# EasyEDA Pro project TC264D主板1.0.eprj, schematic Schematic1

## Sheets
1 power: Board Name: Board1; Create Date: 2024-11-12; Page Name: power; Project Name: motor; Schematic Name: Schematic1; Update Date: 2025-04-30; Company: 嘉立创EDA; Page Size: A4; Version: V1.0
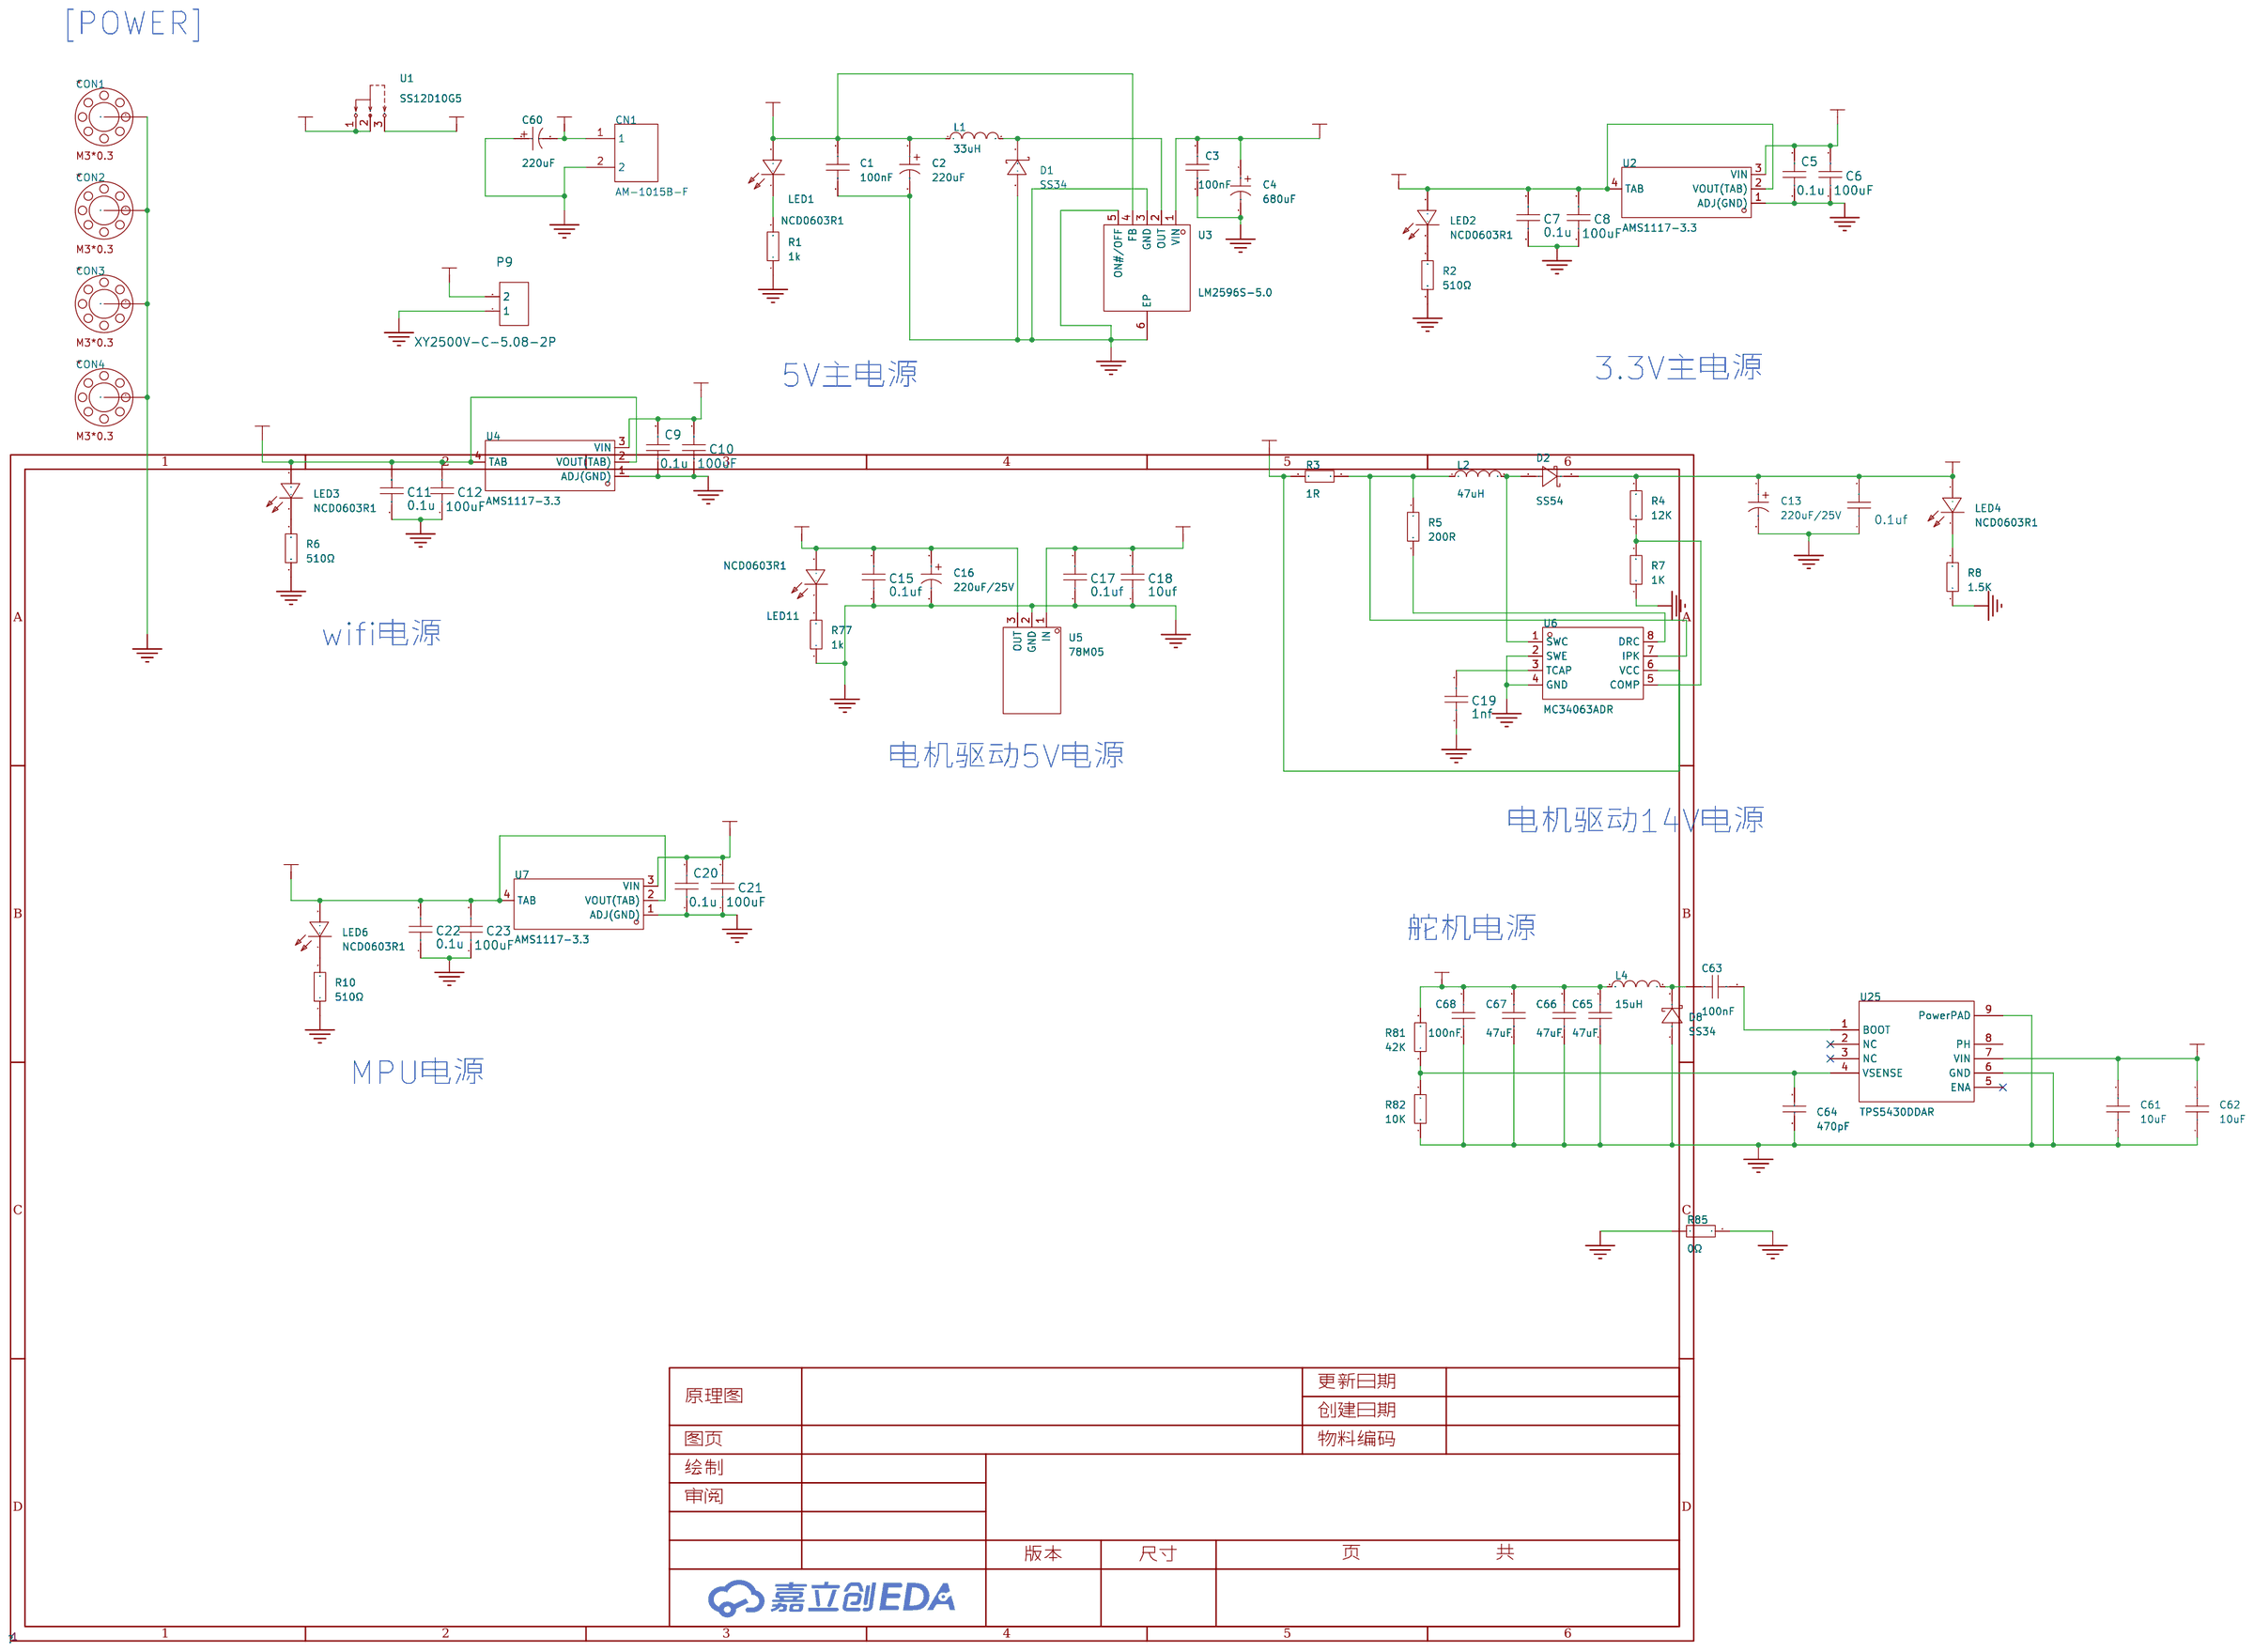
[diagram p0: power]
2 MCU: Create Date: 2025-02-13; Page Name: MCU; Update Date: 2025-05-03
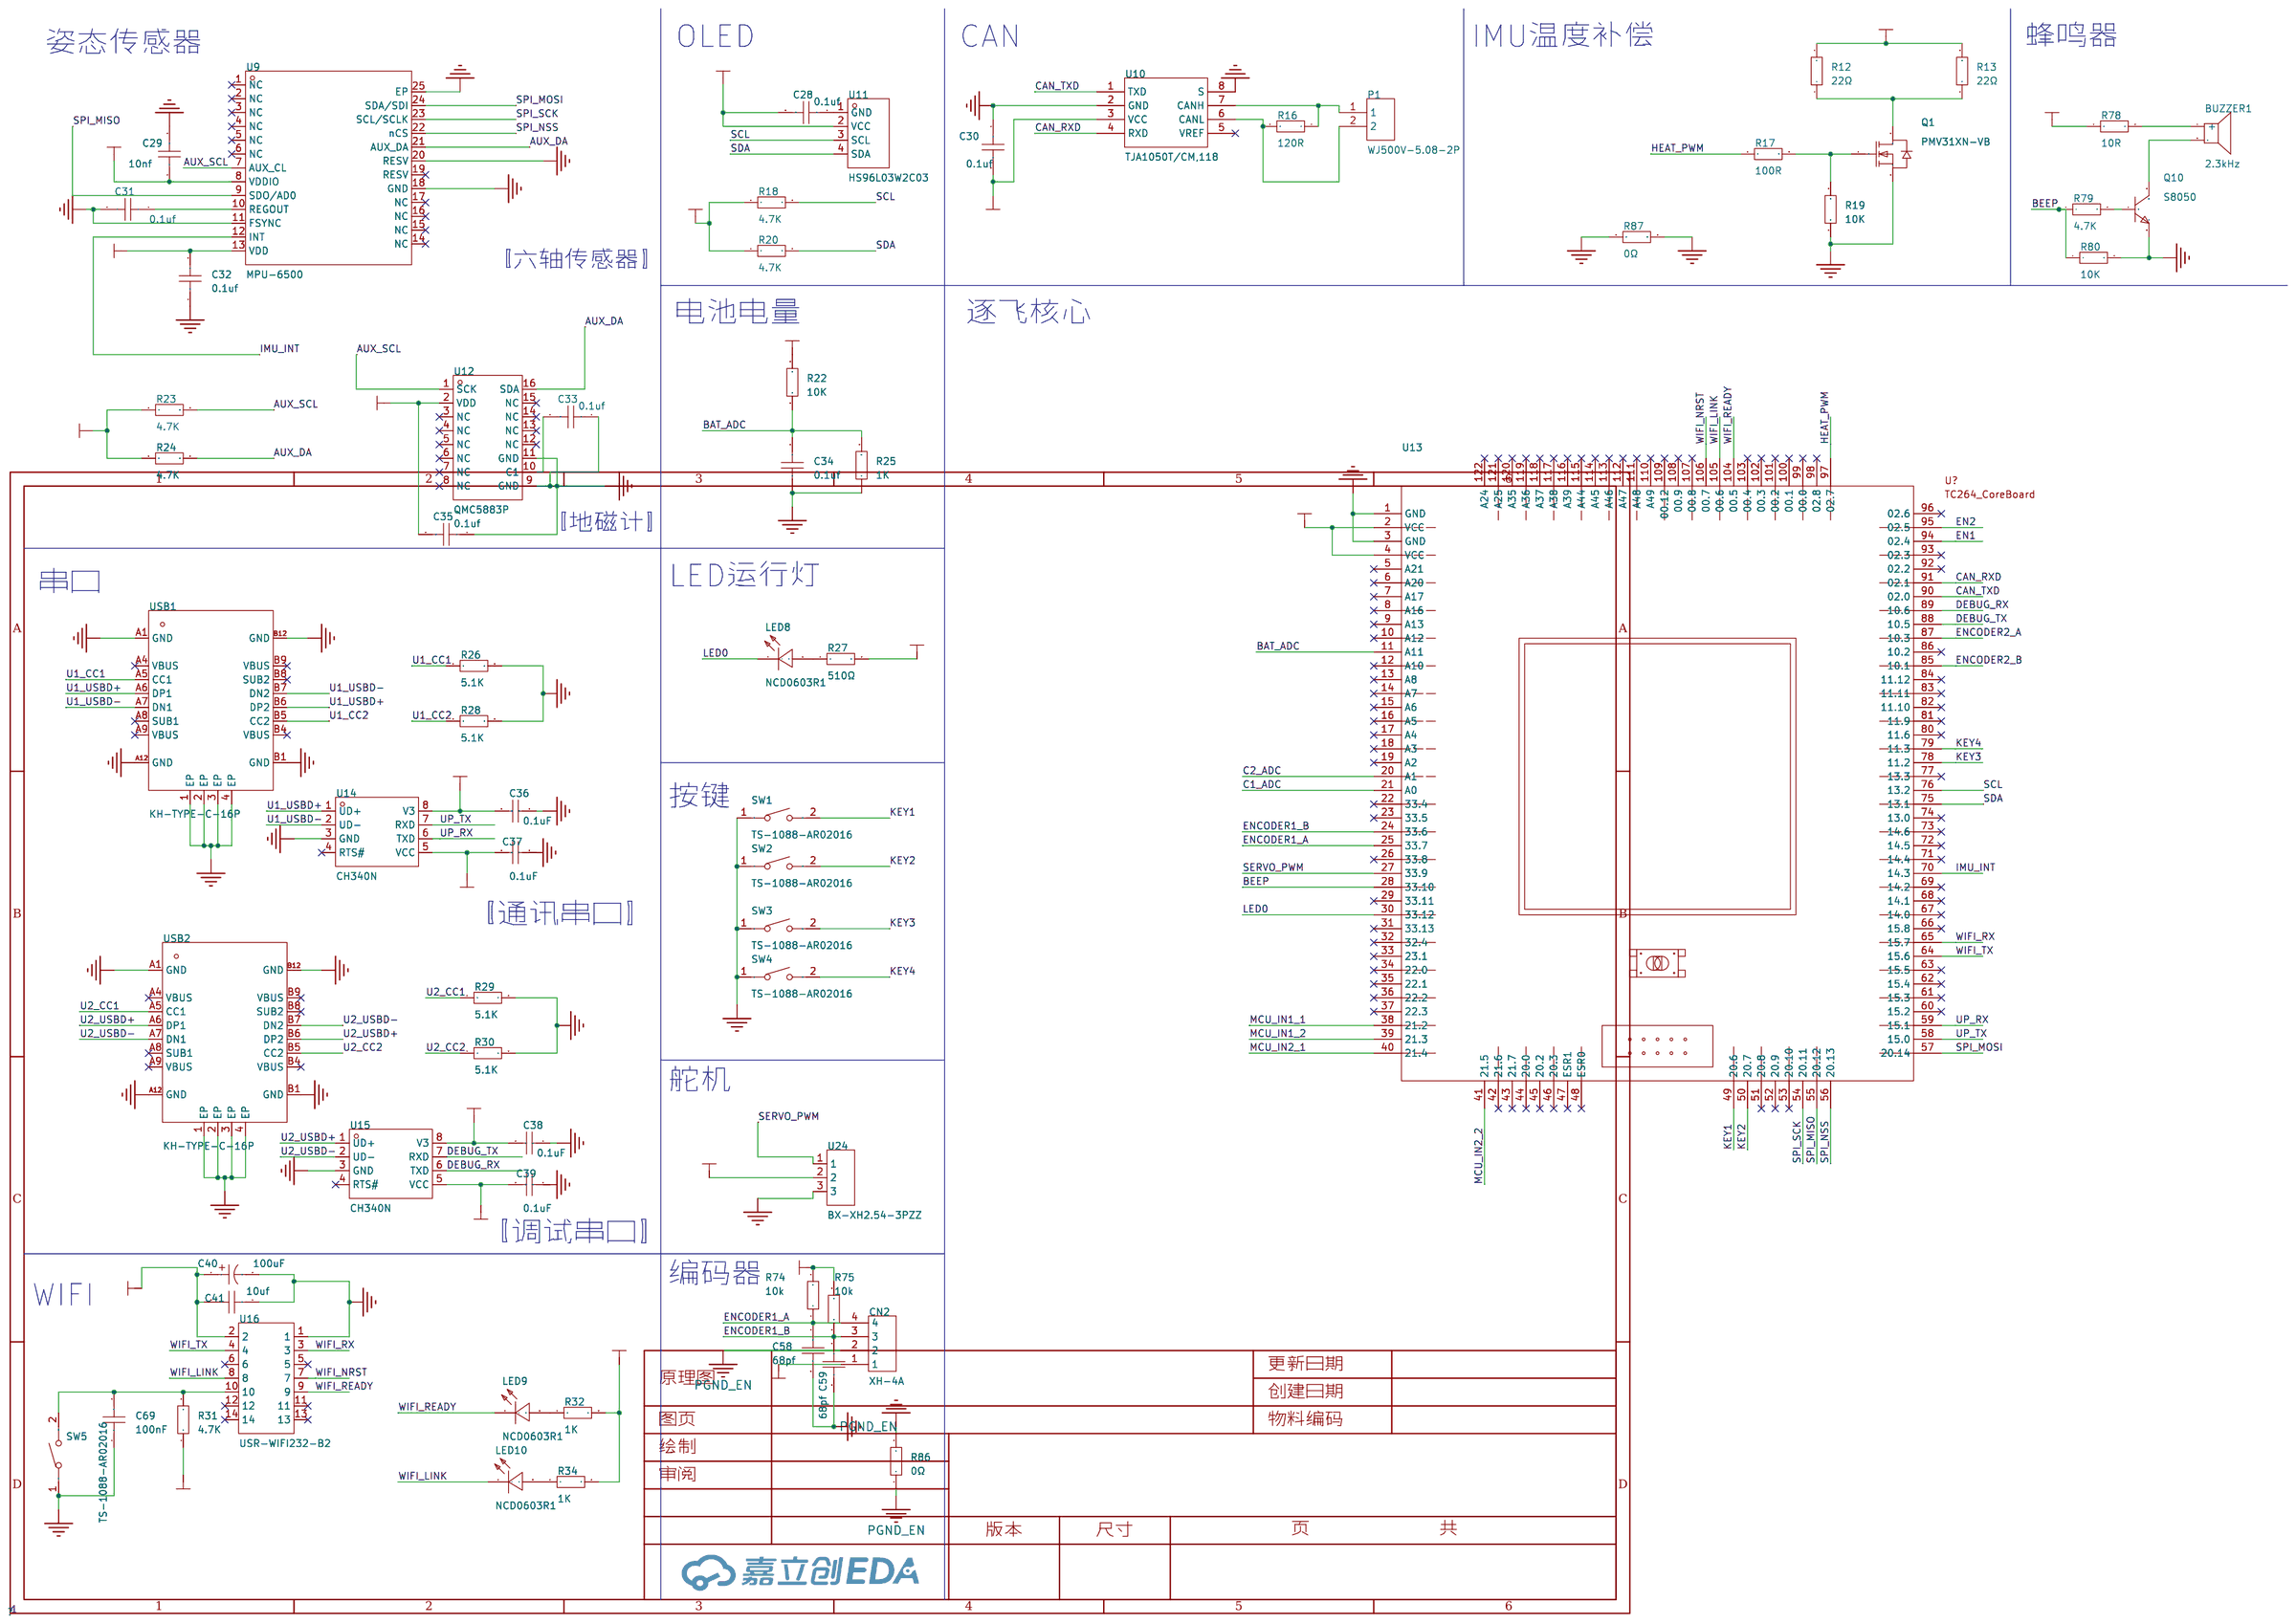
[diagram p1: MCU]
3 motor: Create Date: 2025-02-13; Page Name: motor; Update Date: 2025-04-28
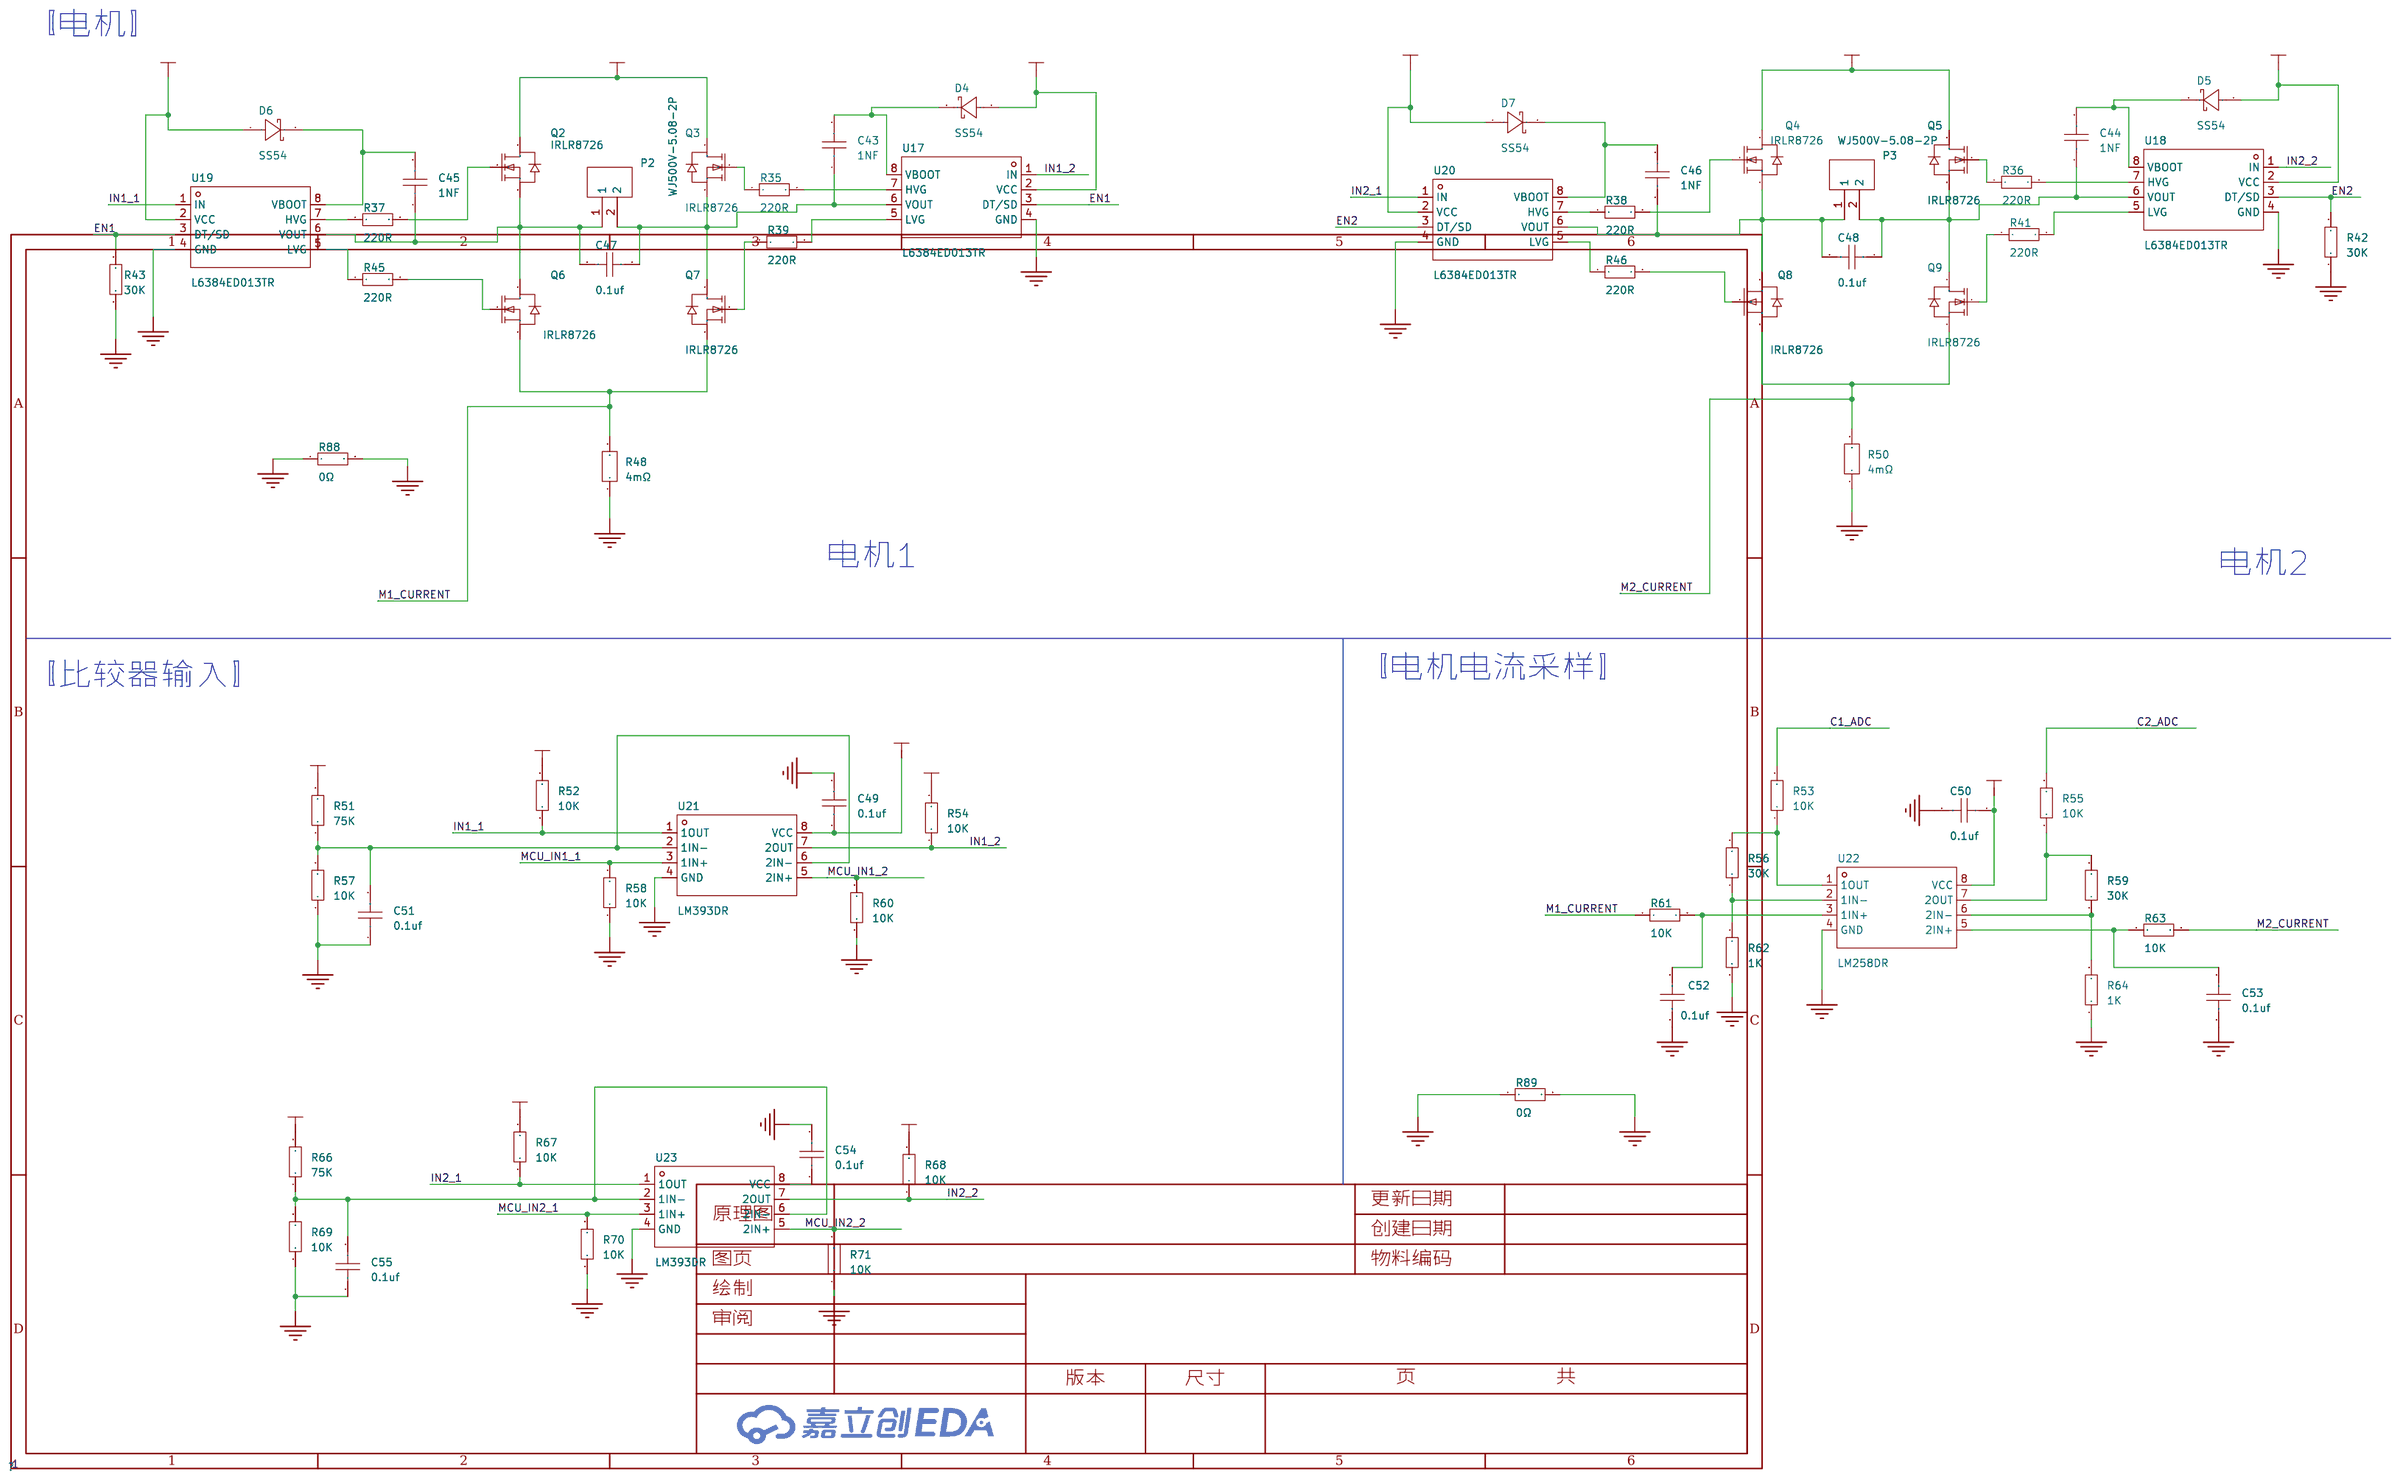
[diagram p2: motor]

## Parts
sheet MCU
BUZZER1  2.3kHz  [BUZ-TH_BD12.0-P7.60-D0.6-FD]
C28  0.1uf  [C0603]  (no BOM)
C29  10nf  [C0603]
C30  0.1uf  [C0603]
C31  0.1uf  [C0603]
C32  0.1uf  [C0603]
C33  0.1uf  [C0603]
C34  0.1uf  [C0603]
C35  0.1uf  [C0603]
C36  0.1uF  [C0603]
C37  0.1uF  [C0603]
C38  0.1uF  [C0603]
C39  0.1uF  [C0603]
C40  100uF  [CAP-SMD_BD5.0-L5.3-W5.3-FD]
C41  10uf  [C0603]
C58  68pf  [C0603]
C59  68pf  [C0603]
C69  100nF  [C0603]
CN2  XH-4A  [CONN-TH_4P-P2.50_XH-4A]
LED8  NCD0603R1  [LED0603-RD_RED]
LED9  NCD0603R1  [LED0603-RD_RED]
LED10  NCD0603R1  [LED0603-RD_RED]
P1  WJ500V-5.08-2P  [CONN-TH_2P-P5.00_WJ500V-5.08-2P]
Q1  PMV31XN-VB  [SOT-23-3_L2.9-W1.5-P1.90-LS2.6-BR]
Q10  S8050  [SOT-23-3_L2.9-W1.3-P1.90-LS2.3-BR]
R12  22Ω  [R1206]
R13  22Ω  [R1206]
R16  120R  [R0603]
R17  100R  [R0603]
R18  4.7K  [R0603]  (no BOM)
R19  10K  [R0603]
R20  4.7K  [R0603]  (no BOM)
R22  10K  [R0603]
R23  4.7K  [R0603]
R24  4.7K  [R0603]
R25  1K  [R0603]
R26  5.1K  [R0603]
R27  510Ω  [R0603]
R28  5.1K  [R0603]
R29  5.1K  [R0603]
R30  5.1K  [R0603]
R31  4.7K  [R0603]
R32  1K  [R0603]
R34  1K  [R0603]
R74  10k  [R0603]
R75  10k  [R0603]
R78  10R  [R0603]
R79  4.7K  [R0603]
R80  10K  [R0603]
R86  0Ω  [R1206]
R87  0Ω  [R1206]
SW1  TS-1088-AR02016  [SW-SMD_L3.9-W3.0-P4.45]
SW2  TS-1088-AR02016  [SW-SMD_L3.9-W3.0-P4.45]
SW3  TS-1088-AR02016  [SW-SMD_L3.9-W3.0-P4.45]
SW4  TS-1088-AR02016  [SW-SMD_L3.9-W3.0-P4.45]
SW5  TS-1088-AR02016  [SW-SMD_L3.9-W3.0-P4.45]
U9  MPU-6500  [QFN-24_L3.0-W3.0-P0.40-BL-EP]
U10  TJA1050T/CM,118  [SOIC-8_L5.0-W4.0-P1.27-LS6.0-BL]
U11  HS96L03W2C03  [OLED-TH_L27.8-W27.2-P2.54_C9900033791]  (no BOM)
U12  QMC5883P  [LGA-16_L3.0-W3.0-P0.50-BL_SQ]
U13  -  [逐飞核心板]
U14  CH340N  [SOP-8_L4.9-W3.9-P1.27-LS6.0-BL]
U15  CH340N  [SOP-8_L4.9-W3.9-P1.27-LS6.0-BL]
U16  USR-WIFI232-B2  [COMM-TH_USR-WIFI232-B2]
U24  BX-XH2.54-3PZZ  [CONN-TH_3P-P2.50_BX-XH2.54-3PZZ]
USB1  KH-TYPE-C-16P  [USB-C-SMD_KH-TYPE-C-16P]
USB2  KH-TYPE-C-16P  [USB-C-SMD_KH-TYPE-C-16P]
sheet motor
C43  1NF  [C0603]
C44  1NF  [C0603]
C45  1NF  [C0603]
C46  1NF  [C0603]
C47  0.1uf  [C0805]
C48  0.1uf  [C0805]
C49  0.1uf  [C0603]
C50  0.1uf  [C0603]
C51  0.1uf  [C0603]
C52  0.1uf  [C0603]
C53  0.1uf  [C0603]
C54  0.1uf  [C0603]  (no BOM)
C55  0.1uf  [C0603]  (no BOM)
D4  SS54  [SMA_L4.3-W2.6-LS5.0-FD]
D5  SS54  [SMA_L4.3-W2.6-LS5.0-FD]
D6  SS54  [SMA_L4.3-W2.6-LS5.0-FD]
D7  SS54  [SMA_L4.3-W2.6-LS5.0-FD]
P2  WJ500V-5.08-2P  [CONN-TH_2P-P5.00_WJ500V-5.08-2P]
P3  WJ500V-5.08-2P  [CONN-TH_2P-P5.00_WJ500V-5.08-2P]
Q2  IRLR8726  [TO-252-2_L6.6-W6.1-P4.57-LS10.1-BR-CW]
Q3  IRLR8726  [TO-252-2_L6.6-W6.1-P4.57-LS10.1-BR-CW]
Q4  IRLR8726  [TO-252-2_L6.6-W6.1-P4.57-LS10.1-BR-CW]
Q5  IRLR8726  [TO-252-2_L6.6-W6.1-P4.57-LS10.1-BR-CW]
Q6  IRLR8726  [TO-252-2_L6.6-W6.1-P4.57-LS10.1-BR-CW]
Q7  IRLR8726  [TO-252-2_L6.6-W6.1-P4.57-LS10.1-BR-CW]
Q8  IRLR8726  [TO-252-2_L6.6-W6.1-P4.57-LS10.1-BR-CW]
Q9  IRLR8726  [TO-252-2_L6.6-W6.1-P4.57-LS10.1-BR-CW]
R35  220R  [R0603]
R36  220R  [R0603]
R37  220R  [R0603]
R38  220R  [R0603]
R39  220R  [R0603]
R41  220R  [R0603]
R42  30K  [R0603]
R43  30K  [R0603]
R45  220R  [R0603]
R46  220R  [R0603]
R48  4mΩ  [RES-SMD_L6.4-W3.2-R2512]
R50  4mΩ  [RES-SMD_L6.4-W3.2-R2512]
R51  75K  [R0603]
R52  10K  [R0603]
R53  10K  [R0603]
R54  10K  [R0603]
R55  10K  [R0603]
R56  30K  [R0603]
R57  10K  [R0603]
R58  10K  [R0603]
R59  30K  [R0603]
R60  10K  [R0603]
R61  10K  [R0603]
R62  1K  [R0603]
R63  10K  [R0603]
R64  1K  [R0603]
R66  75K  [R0603]  (no BOM)
R67  10K  [R0603]  (no BOM)
R68  10K  [R0603]  (no BOM)
R69  10K  [R0603]  (no BOM)
R70  10K  [R0603]  (no BOM)
R71  10K  [R0603]  (no BOM)
R88  0Ω  [R1206]
R89  0Ω  [R1206]
U17  L6384ED013TR  [SOP-8_L4.9-W3.9-P1.27-LS6.0-BL]
U18  L6384ED013TR  [SOP-8_L4.9-W3.9-P1.27-LS6.0-BL]
U19  L6384ED013TR  [SOP-8_L4.9-W3.9-P1.27-LS6.0-BL]
U20  L6384ED013TR  [SOP-8_L4.9-W3.9-P1.27-LS6.0-BL]
U21  LM393DR  [SOIC-8_L5.0-W4.0-P1.27-LS6.0-BL]
U22  LM258DR  [SOIC-8_L5.0-W4.0-P1.27-LS6.0-BL]
U23  LM393DR  [SOIC-8_L5.0-W4.0-P1.27-LS6.0-BL]  (no BOM)
sheet power
C1  100nF  [C0603]
C2  220uF  [CAP-SMD_BD6.3-L6.6-W6.6-FD]
C3  100nF  [C0603]
C4  680uF  [CAP-SMD_BD10.0-L10.3-W10.3-LS10.9-FD]
C5  0.1u  [C0603]
C6  100uF  [C0603]
C7  0.1u  [C0603]
C8  100uF  [C0603]
C9  0.1u  [C0603]
C10  100uF  [C0603]
C11  0.1u  [C0603]
C12  100uF  [C0603]
C13  220uF/25V  [CAP-SMD_BD6.3-L6.6-W6.6-LS7.8-FD]
C14  0.1uf  [C0603]
C15  0.1uf  [C0603]
C16  220uF/25V  [CAP-SMD_BD6.3-L6.6-W6.6-LS7.8-FD]
C17  0.1uf  [C0603]
C18  10uf  [C0603]
C19  1nf  [C0603]
C20  0.1u  [C0603]
C21  100uF  [C0603]
C22  0.1u  [C0603]
C23  100uF  [C0603]
C60  220uF  [CAP-SMD_BD10.0-L10.3-W10.3-LS11.3-FD]
C61  10uF  [C0805]
C62  10uF  [C0805]
C63  100nF  [C0603]
C64  470pF  [C0603]
C65  47uF  [C1206]
C66  47uF  [C1206]
C67  47uF  [C1206]
C68  100nF  [C0603]
CN1  AM-1015B-F  [CONN-TH_AM-1015B-F]
CON1  -  [CON_M3*0.3]
CON2  -  [CON_M3*0.3]
CON3  -  [CON_M3*0.3]
CON4  -  [CON_M3*0.3]
D1  SS34  [SMA_L4.3-W2.6-LS5.0-FD]
D2  SS54  [SMA_L4.3-W2.6-LS5.0-FD]
D8  SS34  [SMA_L4.3-W2.6-LS5.0-FD]
L1  33uH  [IND-SMD_L7.1-W6.6]
L2  47uH  [IND-SMD_L7.3-W6.8]
L4  15uH  [IND-SMD_L7.0-W6.6_FXL0630]
LED1  NCD0603R1  [LED0603-RD_RED]
LED2  NCD0603R1  [LED0603-RD_RED]
LED3  NCD0603R1  [LED0603-RD_RED]
LED4  NCD0603R1  [LED0603-RD_RED]
LED6  NCD0603R1  [LED0603-RD_RED]
LED11  NCD0603R1  [LED0603-RD_RED]
P9  XY2500V-C-5.08-2P  [CONN-TH_XY2500V-C-5.08-2P]
R1  1k  [R0603]
R2  510Ω  [R0603]
R3  1R  [R0603]
R4  12K  [R0603]
R5  200R  [R0603]
R6  510Ω  [R0603]
R7  1K  [R0603]
R8  1.5K  [R0603]
R10  510Ω  [R0603]
R77  1k  [R0603]
R81  42K  [R0603]
R82  10K  [R0603]
R85  0Ω  [R1206]
U1  SS12D10G5  [SW-TH_SHOU-HAN_SS12D10G4]
U2  AMS1117-3.3  [SOT-223-4_L6.5-W3.5-P2.30-LS7.0-BR]
U3  LM2596S-5.0  [TO-263-5_L10.2-W8.9-P1.70-BR]
U4  AMS1117-3.3  [SOT-223-4_L6.5-W3.5-P2.30-LS7.0-BR]
U5  78M05  [TO-252-2_L6.6-W6.1-P4.57-LS9.9-BR-CW]
U6  MC34063ADR  [SOIC-8_L4.9-W3.9-P1.27-LS6.0-BL]
U7  AMS1117-3.3  [SOT-223-4_L6.5-W3.5-P2.30-LS7.0-BR]
U25  TPS5430DDAR  [ESOP-8_L4.9-W3.9-P1.27-LS6.0-TL-EP]

## Library data of the parts
BUZZER1 = TMB12A03: 驱动方式:有源(内含驱动线路);构造类型:电磁式;频率:2.3kHz;声压(SPL):85dB;; Supplier Part: C96222; Manufacturer: 华能; Supplier Footprint: 插件,D=12mm; JLCPCB Part Class: 扩展库; Datasheet: https://atta.szlcsc.com/upload/public/pdf/source/20241025/428C1CFCAF77BD6D816EEFE9285ABDAA.pdf; Supplier: LCSC; Driver Circuitry: 有源(内含驱动线路); Technology: 电磁式; Voltage - Supply: 1.5V~4V; Sound Pressure Level(SPL): 85dB; Diameter(φD): 12mm; Height: 9.8mm
C1 C3 C28-C35 C41 C43-C55 C58 C59 C63 C68 C69 = CAP_0603: Supplier Footprint: 0603
C36-C39 = 0805B104K500NT: 容值:100nF;精度:±10%;额定电压:50V;材质(温度系数):X7R;; LCSC Part Name: 100nF ±10% 50V; Supplier Part: C38141; Manufacturer: FH(风华); Supplier Footprint: 0805; JLCPCB Part Class: Extended Part; Datasheet: https://atta.szlcsc.com/upload/public/pdf/source/20170923/C38141_1506149447419988747.pdf; Supplier: LCSC; Tolerance: ±10%; Voltage Rated: 50V; Temperature Coefficient: X7R
C40 = RVT1A101M0505_C18221491: 容值:100uF;精度:±20%;额定电压:10V;纹波电流:39mA@120Hz;; LCSC Part Name: 100uF ±20% 10V; Supplier Part: C18221491; Manufacturer: RS(容硕); Manufacturer Part: RVT1A101M0505; Supplier Footprint: SMD,D5xL5.4mm; JLCPCB Part Class: 扩展库; Datasheet: https://atta.szlcsc.com/upload/public/pdf/source/20231012/A9BDA4D9DCF59DA62A45967533C4FC4C.pdf; Supplier: LCSC; Tolerance: ±20%; Voltage Rated: 10V; Ripple Current: 39mA@120Hz
CN2 = XH-4A_C37815: 插针结构:1x4P;间距:2.5mm;安装方式:直插;参考系列:XH;总PIN数:4P;排数:1;每排PIN数:4;行距:-;额定电流:-;触头材质:-;触头镀层:-;工作温度:-;; LCSC Part Name: 1x4P 间距:2.5mm 直插 系列:XH; Supplier Part: C37815; Manufacturer: BOOMELE(博穆精密); Supplier Footprint: 插件,P=2.5mm; JLCPCB Part Class: 扩展库; Datasheet: https://atta.szlcsc.com/upload/public/pdf/source/20181205/C146112_2CB31444E6250AC61E2A41A9A8391D5F.pdf; Supplier: LCSC; Pins Structure: 1x4P; Pitch: 2.5mm; Mounting Type: 直插; Reference Series: XH; Number of Pins: 4P; Number of Rows: 1; Number of PINs Per Row: 4
LED1-LED4 LED6 LED8-LED11 = NCD0603R1_C84263: 灯头类型:-;发光颜色:红色;正向电压(VF):1.6V~2.6V;功率:65mW;正向电流:20mA;主波长:615nm~630nm;二极管配置:独立二极管;透镜颜色:无色透明透镜;色温:-;发光强度:80mcd~220mcd;发光角度:130°;载带方式:-;工作温度:-30℃~+85℃;; Supplier Part: C84263; Manufacturer: 国星光电; Supplier Footprint: 0603; JLCPCB Part Class: Extended Part; Datasheet: https://atta.szlcsc.com/upload/public/pdf/source/20200820/C84263_DABC6A75E58F576973B407FDBA283D60.pdf; Supplier: LCSC; Emitted Color: 红色; Forward Voltage (VF): 1.6V~2.6V; Power Dissipation: 65mW; Forward Current: 20mA; Dominant Wavelength: 615nm~630nm; Diode Configuration: 独立二极管; Lens Color: 无色透明透镜; Luminous Intensity: 80mcd~220mcd; Viewing Angle: 130°; Operating Temperature: -30℃~+85℃
P1-P3 = WJ500V-5.08-2P: 结构:1x2P;间距:5.08mm;颜色:绿色;安装方式:直插;额定电流:18A;额定电压:250V;排数:1;线规 - AWG:14~30;线规 - 平方毫米:2.5;每排PIN数:2;触头材质:-;触头镀层:-;工作温度范围:-40℃~+105℃;焊接温度(最大值):-;; LCSC Part Name: 1x2P 5.08mm 直插 排数:1 每排P数:2; Supplier Part: C8465; Manufacturer: KANGNEX(康奈克斯电气); Supplier Footprint: 插件,P=5.08mm; JLCPCB Part Class: 扩展库; Datasheet: https://atta.szlcsc.com/upload/public/pdf/source/20191225/C8465_02D34CE5B5B4A53DF5891601D97FA9F4.pdf; Supplier: LCSC; Structure: 1x2P; Pitch: 5.08mm; Color: 绿色; Mounting Style: 直插; Current Rating (Max): 18A; Voltage Rating (Max): 250V; Number of Pins: 2P; Number of Rows: 1; Wire Gauge - AWG: 14~30; Wire Gauge - mm2: 2.5; Number of PINs Per Row: 2; Operating Temperature Range: -40℃~+105℃; Screw Specification: M2.5
Q1 = PMV31XN-VB: 类型:1个N沟道;漏源电压(Vdss):20V;连续漏极电流(Id):6A;导通电阻(RDS(on)@Vgs,Id):-;功率(Pd):1.25W;阈值电压(Vgs(th)@Id):1V@250uA;; LCSC Part Name: 1个N沟道 耐压:20V 电流:6A; Supplier Part: C7525086; Manufacturer: VBsemi(微碧半导体); Supplier Footprint: SOT-23; JLCPCB Part Class: 扩展库; Datasheet: https://atta.szlcsc.com/upload/public/pdf/source/20240805/7B1EFC21D2F0ED81C5E32452D1D3D610.pdf; Supplier: LCSC; Type: 1个N沟道; Drain Source Voltage (Vdss): 20V; Continuous Drain Current (Id): 6A; Power Dissipation (Pd): 1.25W; Gate Threshold Voltage (Vgs(th)@Id): 1V@250uA; Total Gate Charge (Qg@Vgs): 8.8nC@4.5V; Input Capacitance (Ciss@Vds): 865pF@10V; Reverse Transfer Capacitance (Crss@Vds): 55pF@10V; Operating Temperature: -55℃~+150℃@(Tj)
Q10 = S8050_C20069125: 晶体管类型:NPN;集电极电流(Ic):500mA;集射极击穿电压(Vceo):25V;耗散功率(Pd):300mW;直流电流增益(hFE):120@50mA,1.0V;; LCSC Part Name: hFE:200-350，丝印:J3Y S8050; Supplier Part: C20069125; Manufacturer: 宏嘉诚; Supplier Footprint: SOT-23; JLCPCB Part Class: 扩展库; Datasheet: https://atta.szlcsc.com/upload/public/pdf/source/20250107/343E8B94B5C24D0D65D7D4B70E0B73F6.pdf; Supplier: LCSC; type: NPN; Current - Collector(Ic): 500mA; Collector - Emitter Voltage VCEO: 25V; Pd - Power Dissipation: 300mW; DC Current Gain: 120@50mA,1.0V; Transition frequency(fT): 100MHz; Current - Collector Cutoff: 100nA; Vce Saturation(VCE(sat)): 600mV; Operating Temperature: -55℃~+150℃
R12 R13 = 1206W4F220JT5E: 电阻类型:厚膜电阻;阻值:22Ω;精度:±1%;功率:250mW;最大工作电压:200V;温度系数:±100ppm/℃;; LCSC Part Name: 22Ω ±1% 250mW 厚膜电阻; Supplier Part: C17958; Manufacturer: UNI-ROYAL(厚声); Supplier Footprint: 1206; JLCPCB Part Class: Basic Part; Datasheet: https://atta.szlcsc.com/upload/public/pdf/source/20200306/C422600_1E6D84923E4A46A82E41ADD87F860B5C.pdf; Supplier: LCSC; Type: 厚膜电阻; Tolerance: ±1%; Power(Watts): 250mW; Overload Voltage (Max): 200V; Temperature Coefficient: ±100ppm/℃; Operating Temperature Range: -55℃~+155℃
R3-R5 R7 R16-R20 R22-R25 R31 R35-R39 R41-R43 R45 R46 R51-R64 R66-R71 R78-R82 = Res_0603: Supplier Footprint: 0603
R26 R28-R30 = 0805W8F1002T5E_C17414: 电阻类型:厚膜电阻;阻值:10kΩ;精度:±1%;功率:125mW;; LCSC Part Name: 10kΩ ±1% 125mW; Supplier Part: C17414; Manufacturer: UNI-ROYAL(厚声); Manufacturer Part: 0805W8F1002T5E; Supplier Footprint: 0805; JLCPCB Part Class: 基础库; Datasheet: https://atta.szlcsc.com/upload/public/pdf/source/20200306/C422600_1E6D84923E4A46A82E41ADD87F860B5C.pdf; Supplier: LCSC; Type: 厚膜电阻; Tolerance: ±1%; Power(Watts): 125mW; Temperature Coefficient: ±100ppm/℃; Overload Voltage (Max): 150V; Operating Temperature Range: -55℃~+155℃
R1 R2 R6 R8 R10 R27 R32 R34 R74 R75 R77 = 0805W8F5100T5E: 电阻类型:厚膜电阻;阻值:510Ω;精度:±1%;功率:125mW;; LCSC Part Name: 510Ω ±1% 125mW; Supplier Part: C17734; Manufacturer: UNI-ROYAL(厚声); Supplier Footprint: 0805; JLCPCB Part Class: Basic Part; Datasheet: https://atta.szlcsc.com/upload/public/pdf/source/20200306/C422600_1E6D84923E4A46A82E41ADD87F860B5C.pdf; Supplier: LCSC; Type: 厚膜电阻; Tolerance: ±1%; Power(Watts): 125mW; Temperature Coefficient: ±100ppm/℃; Overload Voltage (Max): 150V; Operating Temperature Range: -55℃~+155℃
R85-R89 = 1206W4F0000T5E: 电阻类型:厚膜电阻;阻值:0Ω;精度:±1%;功率:250mW;最大工作电压:200V;温度系数:±800ppm/℃;; LCSC Part Name: 0Ω ±1% 250mW 厚膜电阻; Supplier Part: C17888; Manufacturer: UNI-ROYAL(厚声); Supplier Footprint: 1206; JLCPCB Part Class: 基础库; Datasheet: https://atta.szlcsc.com/upload/public/pdf/source/20200306/C422600_1E6D84923E4A46A82E41ADD87F860B5C.pdf; Supplier: LCSC; Type: 厚膜电阻; Tolerance: ±1%; Power(Watts): 250mW; Overload Voltage (Max): 200V; Temperature Coefficient: ±800ppm/℃; Operating Temperature Range: -55℃~+155℃
SW1-SW5 = TS-1088-AR02016: 电路结构:单刀单掷;按钮形状:圆形按钮;作用力:160gf;安装方式:立贴;开关长度:4mm;开关宽度:3mm;开关高度:2mm;带支架:不带;触点电流:50mA;额定电压(DC):12V;绝缘电阻:100MΩ;机械寿命:10万次;; LCSC Part Name: 4*3*2mm 立贴 轻触开关; Supplier Part: C720477; Manufacturer: XUNPU(讯普); Supplier Footprint: SMD; JLCPCB Part Class: 扩展库; Datasheet: https://atta.szlcsc.com/upload/public/pdf/source/20200810/C720475_60D09DD6C54279ADDB2DC25100F1CC11.pdf; Supplier: LCSC; Circuit: 单刀单掷; Actuator Style: 圆形按钮; Operating Force: 160gf; Mounting Style: 立贴; Switch Length: 4mm; Switch Width: 3mm; Switch Height: 2mm; Strike Gundam: 不带; Contact Current: 50mA; Voltage Rating (DC): 12V; Insulation Resistance: 100MΩ; Actuator/Cap Color: 黑色; Pin Style: SMD接片; Mechanical Life: 10万次; Operating Temperature: -30℃~+80℃
U9 = MPU-6500_C50278: 传感器类型:加速度计陀螺仪;; Supplier Part: C50278; Manufacturer: TDK InvenSense(应美盛); Supplier Footprint: QFN-24-EP(3x3); JLCPCB Part Class: 扩展库; Datasheet: https://atta.szlcsc.com/upload/public/pdf/source/20170505/1493957890595.pdf; Supplier: LCSC; Sensor Type: 加速度计陀螺仪; Operating Temperature: -40℃~+85℃
U10 = TJA1050T/CM,118: 类型:-;; LCSC Part Name: 4.75V~5.25V; Supplier Part: C6952; Manufacturer: NXP(恩智浦); Supplier Footprint: SOP-8; JLCPCB Part Class: 扩展库; Datasheet: https://www.nxp.com/docs/en/data-sheet/TJA1050.pdf; Supplier: LCSC; Supply Voltage: 4.75V~5.25V; Supply Current: 50mA
U11 = HS96L03W2C03: 主控芯片:SSD1315;接口类型:I2C;尺寸(inch):0.96;像素分辨率:128x64;; LCSC Part Name: 0.96寸OLED显示屏窄白光IIC; Supplier Part: C5248080; Manufacturer: HS(汉昇); JLCPCB Part Class: 扩展库; Datasheet: https://atta.szlcsc.com/upload/public/pdf/source/20230627/763D01F79A90007632F098068C7C8AD9.pdf; Supplier: LCSC; Main Control Chip: SSD1315; Interface Type: I2C; Size: 0.96; Pixel Resolution: 128x64; Operating Temperature: -40℃~+70℃
U12 = QMC5883P: LCSC Part Name: 三轴磁传感器; Supplier Part: C2847467; Manufacturer: QST(上海矽睿); Supplier Footprint: LGA-16(3x3); JLCPCB Part Class: 扩展库; Datasheet: https://atta.szlcsc.com/upload/public/pdf/source/20210716/C2847467_A90ABEF37B1EC59AF528AF03CB0C7271.pdf; Supplier: LCSC
U13 = tc264逐飞核心板
U14 U15 = CH340N: LCSC Part Name: USB转串口芯片 CH340; Supplier Part: C2977777; Manufacturer: WCH(南京沁恒); Supplier Footprint: SOP-8; JLCPCB Part Class: 扩展库; Datasheet: https://atta.szlcsc.com/upload/public/pdf/source/20220223/82A45E4FF89B3EDCAD50B354450A7EF4.pdf; Supplier: LCSC
U16 = USR-WIFI232-B2: LCSC Part Name: WIFI/以太网 透传模块,外置天线,需另配2.4G天线使用; Supplier Part: C250563; Manufacturer: USR(有人物联网); Supplier Footprint: SMD; JLCPCB Part Class: 扩展库; Datasheet: https://atta.szlcsc.com/upload/public/pdf/source/20180801/C250563_E3CDB6C7BB01B0CE86E206FDB869E694.pdf; Supplier: LCSC
U24 = BX-XH2.54-3PZZ: 插针结构:1x3P;间距:2.5mm;安装方式:直插;参考系列:XH;总PIN数:3P;排数:1;每排PIN数:3;行距:-;额定电流:3A;触头材质:黄铜;触头镀层:锡;工作温度:-25℃~+85℃;; LCSC Part Name: 1x3P 间距:2.5mm 直插 系列:XH; Supplier Part: C18077834; Manufacturer: Bossie(博锡); Supplier Footprint: 插件,P=2.54mm; JLCPCB Part Class: 扩展库; Datasheet: https://atta.szlcsc.com/upload/public/pdf/source/20231017/BF89167887E1F965B2791D14EC788A09.pdf; Supplier: LCSC; Pins Structure: 1x3P; Pitch: 2.5mm; Mounting Type: 直插; Reference Series: XH; Number of Pins: 3P; Number of Rows: 1; Number of PINs Per Row: 3; Current Rating: 3A; Contact Material: 黄铜; Contact Plating: 锡; Operating Temperature: -25℃~+85℃; Voltage Rating: 250V; Plastic Material: PA66; Flame Retardant Rating: UL94V-0; Color: 白色; Z-Height of the Board: 7mm; X-Length of Bottom Edge on Board (Spacing Line): 10mm; Y-Width of Bottom Edge on Board: 5.9mm
USB1 USB2 = KH-TYPE-C-16P: 连接器类型:Type-C;标准:-;公母:母座;触点数量:16;端口数量:1;安装方式:卧贴;额定电流 - 电源:3A;工作温度范围:-40℃~+85℃;; LCSC Part Name: Type-C 母座 卧贴; Supplier Part: C709357; Manufacturer: kinghelm(金航标); Supplier Footprint: SMD; JLCPCB Part Class: Extended Part; Datasheet: https://atta.szlcsc.com/upload/public/pdf/source/20200911/C709357_AA8DCEB38BB20E3035A7ED7AE7667837.pdf; Supplier: LCSC; Connector Type: Type-C; Gender: 母座; Number of Contacts: 16; Number of Ports: 1; Mounting Style: 卧贴; Current Rating - Power (Max): 3A; Operating Temperature Range: -40℃~+85℃
D2 D4-D7 = SS54_C7420369: 二极管配置:独立式;正向压降(Vf):550mV@5.0A;直流反向耐压(Vr):40V;整流电流:5A;; LCSC Part Name: 电压:40V 电流:5A; Supplier Part: C7420369; Manufacturer: 宏迦橙; Supplier Footprint: SMA(DO-214AC); JLCPCB Part Class: 扩展库; Datasheet: https://atta.szlcsc.com/upload/public/pdf/source/20230828/254C3882F8647358AD9F60DD73611B5E.pdf; Supplier: LCSC; Diode Configuration: 独立式; Forward Voltage (Vf@If): 550mV@5.0A; Reverse Voltage (Vr): 40V; Rectified Current: 5A; Reverse Leakage Current (Ir): 50uA@40V
Q2-Q9 = IRLR8726: Supplier Part: C5350860; Manufacturer: TECH PUBLIC(台舟); Supplier Footprint: TO-252; JLCPCB Part Class: 扩展库; Datasheet: https://atta.szlcsc.com/upload/public/pdf/source/20230110/63D2FFB2CCEE235B81FC5B256D6FDE17.pdf; Supplier: LCSC
R48 R50 = HoJLR2512-3W-4mR-1%: 电阻类型:采样电阻;阻值:4mΩ;精度:±1%;功率:3W;安装方式:贴片;; LCSC Part Name: 4mΩ ±1% 3W; Supplier Part: C2904236; Manufacturer: Milliohm(毫欧); Supplier Footprint: 2512; JLCPCB Part Class: 扩展库; Datasheet: https://atta.szlcsc.com/upload/public/pdf/source/20211009/7525CABAB363C979E942C1DD41F1FEF0.pdf; Supplier: LCSC; Type: 采样电阻; Tolerance: ±1%; Power(Watts): 3W; Mounting Sytle: 贴片
U17-U20 = L6384ED013TR: 驱动配置:半桥;负载类型:MOSFET；IGBT;驱动通道数:2;峰值灌电流:650mA;峰值拉电流:400mA;电源电压:14.6V~16.6V;上升时间:50ns;下降时间:30ns;; Supplier Part: C17119; Manufacturer: ST(意法半导体); Supplier Footprint: SOP-8; JLCPCB Part Class: 扩展库; Datasheet: https://atta.szlcsc.com/upload/public/pdf/source/20140724/1457707162180.pdf; Supplier: LCSC; Driven Configuration: 半桥; Load Type: MOSFET；IGBT; Number of Drivers: 2; Peak Output Current(sink): 650mA; Peak Output Current(source): 400mA; Supply Voltage: 14.6V~16.6V; Rise Time: 50ns; Fall Time: 30ns; Operating Temperature: -45℃~+125℃@(Tj)
U21 U23 = LM393DR: 输入失调电压(Vos):5mV;输入偏置电流(Ib):250nA;; Supplier Part: C67470; Manufacturer: TI(德州仪器); Supplier Footprint: SOIC-8; JLCPCB Part Class: 扩展库; Datasheet: https://www.ti.com/cn/lit/gpn/lm393; Supplier: LCSC; Input Offset Voltage (Vos): 5mV; Input Bias Current (Ib): 250nA; Supply Voltage: 1V~18V；2V~36V; Output Type: 开集; Supply Current: 2.5mA; Operating Temperature: 0℃~+70℃
U22 = LM258DR: 放大器数:双路;增益带宽积(GBP):700kHz;压摆率(SR):0.3V/us;输入偏置电流(Ib):20nA;; LCSC Part Name: 行业标准双路运算放大器; Supplier Part: C7928; Manufacturer: TI(德州仪器); Supplier Footprint: SOIC-8; JLCPCB Part Class: 扩展库; Datasheet: https://www.ti.com/cn/lit/gpn/lm258; Supplier: LCSC; Number of Circuits: 双路; Gain Bandwidth Product(GBP): 700kHz; Slew Rate(SR): 0.3V/us; Current - Input Bias(Ib): 20nA; Quiescent Current: 1mA; Output Current: 40mA; Operating Temperature: -25℃~+85℃
C2 = RVT220UF16V67RV0015: 容值:220uF;精度:±20%;额定电压:16V;纹波电流:110mA@120Hz;等效串联电阻:-;; LCSC Part Name: 220uF ±20% 16V; Supplier Part: C2887273; Manufacturer: KNSCHA(科尼盛); Supplier Footprint: SMD,D6.3xL7.7mm; JLCPCB Part Class: 扩展库; Datasheet: https://atta.szlcsc.com/upload/public/pdf/source/20210824/3DC9999D9B098FE241E3A26137981C4C.pdf; Supplier: LCSC; Tolerance: ±20%; Rated Voltage: 16V; Ripple Current: 110mA@120Hz; φD: 6.3mm; L: 7.7mm; Lifetime @ Temp: 2000hrs@105℃; Operating Temperature: -55℃~+105℃
C4 = GVM1V681M1010: 容值:680uF;精度:±20%;额定电压:35V;纹波电流:1.19A@120Hz;等效串联电阻:60mΩ@120Hz;; LCSC Part Name: 680uF ±20% 35V; Supplier Part: C2980172; Manufacturer: HONOR(荣誉); Supplier Footprint: SMD,D10xL10.5mm; JLCPCB Part Class: 扩展库; Datasheet: https://atta.szlcsc.com/upload/public/pdf/source/20220509/EB2A569F0F3393644DE07704993C28AA.pdf; Supplier: LCSC; Tolerance: ±20%; Rated Voltage: 35V; Ripple Current: 1.19A@120Hz; Equivalent Series Resistance(ESR): 60mΩ@120Hz; φD: 10mm; L: 10.2mm; Lifetime @ Temp: 5000hrs@105℃; Operating Temperature: -55℃~+105℃
C5 C9 C20 = 0.1u
C6 C8 C10 C12 C21 C23 = HGC1206R5107M100NSPJ: 容值:100uF;精度:±20%;额定电压:10V;材质(温度系数):X5R;; LCSC Part Name: 100uF ±20% 10V; Supplier Part: C7432784; Manufacturer: Chinocera(华瓷); Supplier Footprint: 1206; JLCPCB Part Class: Extended Part; Datasheet: https://atta.szlcsc.com/upload/public/pdf/source/20240320/FAC3FEC40A78BC5CCCE96C232A94D860.pdf; Supplier: LCSC; Tolerance: ±20%; Voltage Rated: 10V; Temperature Coefficient: X5R
C7 C11 C14 C15 C17-C19 C22 = 0.1u_C0805
C13 C16 = GVT1E227M0608CNVC: 容值:220uF;精度:±20%;额定电压:25V;纹波电流:120mA@120Hz;; LCSC Part Name: 220uF ±20% 25V; Supplier Part: C2983317; Manufacturer: HRK(鸿瑞凯电子); Supplier Footprint: SMD,D6.3xL7.7mm; JLCPCB Part Class: 扩展库; Datasheet: https://atta.szlcsc.com/upload/public/pdf/source/20220321/A04A91A46495B899B204BF58325E1842.pdf; Supplier: LCSC; Tolerance: ±20%; Rated Voltage: 25V; Ripple Current: 120mA@120Hz; φD: 6.3mm; L: 8mm; Lifetime @ Temp: 2000hrs@105℃; Operating Temperature: -55℃~+105℃
C60 = RVT1H221M1010_C72499: 容值:220uF;精度:±20%;额定电压:50V;纹波电流:230mA@120Hz;等效串联电阻(ESR):-;; LCSC Part Name: 220uF ±20% 50V; Supplier Part: C72499; Manufacturer: ROQANG(容强); Manufacturer Part: RVT1H221M1010; Supplier Footprint: SMD,D10xL10.2mm; JLCPCB Part Class: 扩展库; Datasheet: https://atta.szlcsc.com/upload/public/pdf/source/20170325/1490427950282.pdf; Supplier: LCSC; Tolerance: ±20%; Voltage Rating: 50V; Ripple Current: 230mA@120Hz; Diameter: 10mm; Height - Seated (Max): 10.2mm; Lifetime: 2000hrs@105℃; Operating Temperature: -40℃~+105℃
C61 C62 = CL21A106KAYNNNE_C15850: 容值:10uF;精度:±10%;额定电压:25V;材质(温度系数):X5R;; LCSC Part Name: 10uF ±10% 25V; Supplier Part: C15850; Manufacturer: SAMSUNG(三星); Manufacturer Part: CL21A106KAYNNNE; Supplier Footprint: 0805; JLCPCB Part Class: 基础库; Datasheet: https://atta.szlcsc.com/upload/public/pdf/source/20160218/1457707763339.pdf; Supplier: LCSC; Tolerance: ±10%; Voltage Rated: 25V; Temperature Coefficient: X5R
C64 = CC0603JRNPO9BN471: 容值:470pF;精度:±5%;额定电压:50V;材质(温度系数):NP0;; LCSC Part Name: 470pF ±5% 50V; Supplier Part: C106211; Manufacturer: YAGEO(国巨); Supplier Footprint: 0603; JLCPCB Part Class: 扩展库; Datasheet: https://atta.szlcsc.com/upload/public/pdf/source/20170505/1493957838062.pdf; Supplier: LCSC; Tolerance: ±5%; Voltage Rated: 50V; Temperature Coefficient: NP0
C65-C67 = CL31A476MPHNNNE: 容值:47uF;精度:±20%;额定电压:10V;材质(温度系数):X5R;; LCSC Part Name: 47uF ±20% 10V; Supplier Part: C96123; Manufacturer: SAMSUNG(三星); Supplier Footprint: 1206; JLCPCB Part Class: 基础库; Datasheet: https://atta.szlcsc.com/upload/public/pdf/source/20160218/1457707763339.pdf; Supplier: LCSC; Tolerance: ±20%; Voltage Rated: 10V; Temperature Coefficient: X5R
CN1 = AM-1015B-F: 类别:-;类型1:-;; LCSC Part Name: AMASS(艾迈斯) 防滑T插T型插头紫红大电流航空连接器AM-1015B-F; Supplier Part: C90630; Manufacturer: AMASS(艾迈斯); JLCPCB Part Class: 扩展库; Datasheet: https://atta.szlcsc.com/upload/public/pdf/source/20161217/1481939174683.pdf; Supplier: LCSC; Brand: 艾迈斯; Type: T行插头; RatedVoltage: DC 500V; InterfaceType: 公母头; MetalMaterial: 铜镀金; InsulationMaterial: PA; RatedCurrent: 25A; RecommendedWireGauge: 12AWG; FlameRetardantGrade: UL94 V0; contact resistance: 0.45mΩ
CON1-CON4 = CON_M3*0.3: M3螺丝孔
D1 D8 = SS34_C7420365: 二极管配置:独立式;正向压降(Vf):550mV@3.0A;直流反向耐压(Vr):40V;平均整流电流(Io):3A;; LCSC Part Name: 电压:40V 电流:3A; Supplier Part: C7420365; Manufacturer: 宏迦橙; Supplier Footprint: SMA(DO-214AC); JLCPCB Part Class: Extended Part; Datasheet: https://atta.szlcsc.com/upload/public/pdf/source/20230828/75438452AEE6C276EDA92B2AF599BE05.pdf; Supplier: LCSC; Diode Configuration: 独立式; Forward Voltage (Vf@If): 550mV@3.0A; Reverse Voltage (Vr): 40V; Average Rectified Current (Io): 3A; Reverse Leakage Current (Ir): 200uA@40V; Peak forward surge current: 80A
L1 = SMMS0650-330M: 电感值:33uH;精度:±20%;额定电流:2.3A;饱和电流(Isat):3.3A;类型:一体成型电感;; LCSC Part Name: 33uH ±20% 3.3A; Supplier Part: C149587; Manufacturer: SXN(顺翔诺); Supplier Footprint: SMD,6.6x7.1mm; JLCPCB Part Class: 扩展库; Datasheet: https://atta.szlcsc.com/upload/public/pdf/source/20210810/BBF24330FB2F5029F637830BA9C42C0D.pdf; Supplier: LCSC; Tolerance: ±20%; Rated Current: 2.3A; Saturation Current (Isat): 3.3A; DC Resistance (DCR): 200mΩ; Type: 一体成型电感
L2 = FXL0650-470-M: 电感值:47uH;精度:±20%;额定电流:2A;饱和电流(Isat):2.6A;类型:一体成型电感;; LCSC Part Name: 47uH ±20% 2.6A; Supplier Part: C475527; Manufacturer: cjiang(长江微电); Supplier Footprint: SMD,6.6x7mm; JLCPCB Part Class: 扩展库; Datasheet: https://atta.szlcsc.com/upload/public/pdf/source/20240426/3189EA8206330E2108542F9E34E540E7.pdf; Supplier: LCSC; Tolerance: ±20%; Rated Current: 2A; Saturation Current (Isat): 2.6A; DC Resistance (DCR): 230mΩ; Type: 一体成型电感
L4 = FXL0630-150-M: 电感值:15uH;精度:±20%;额定电流:3A;饱和电流(Isat):4.5A;类型:一体成型电感;; LCSC Part Name: 15uH ±20% 4.5A; Supplier Part: C177243; Manufacturer: cjiang(长江微电); Supplier Footprint: SMD,6.6x7mm; JLCPCB Part Class: 扩展库; Datasheet: https://atta.szlcsc.com/upload/public/pdf/source/20240426/3189EA8206330E2108542F9E34E540E7.pdf; Supplier: LCSC; Tolerance: ±20%; Rated Current: 3A; Saturation Current (Isat): 4.5A; DC Resistance (DCR): 115mΩ; Type: 一体成型电感
P9 = XY2500V-C-5.08-2P: 连接器类型:板端/插座-开口;间距:5.08mm;排数:1;每排PIN数:2;安装方式:直针;额定电流:-;额定电压:-;线规 - AWG:-;线规 - mm?:-;颜色:绿色;; LCSC Part Name: 板端/插座-开口 5.08mm 排数:1 每排P数:2 直针; Supplier Part: C505770; Manufacturer: XINLAIYA(新莱亚); Supplier Footprint: 直插,P=5.08mm; JLCPCB Part Class: Extended Part; Datasheet: https://atta.szlcsc.com/upload/public/pdf/source/20200331/C505762_203BBA30CC567BF272D649DCBBD7E810.pdf; Supplier: LCSC; Connector Type: 板端/插座-开口; Pitch: 5.08mm; Number of Rows: 1; Number of PINs Per Row: 2; Mounting Style: 直针; Color: 绿色; Operating Temperature Range: -40℃~+105℃
U1 = SS12D10G5: 电路结构:单刀双掷;安装方式:直插;额定电流(DC):2A;额定电压(DC):125V;机械寿命:3千次;; LCSC Part Name: 两档立式插件 3脚拨动开关 柄长5.0mm; Supplier Part: C7431054; Manufacturer: SHOU HAN(首韩); Supplier Footprint: 插件; JLCPCB Part Class: 扩展库; Datasheet: https://atta.szlcsc.com/upload/public/pdf/source/20231130/7A3DB6A149BF0A1DCFFE64FFC07FE434.pdf; Supplier: LCSC; Circuit: 单刀双掷; Switch Length: 12.7mm; Switch Width: 6.7mm; Mounting Style: 直插; Current Rating (DC): 2A; Voltage Rating (DC): 125V; Mechanical Life: 3千次; Operating Temperature: -25℃~+70℃
U2 U4 U7 = AMS1117-3.3_C347222: 输出类型:固定;工作电压:12V;输出电压:3.3V;输出电流:1A;电源纹波抑制比(PSRR):60dB@(120Hz);输出极性:正极;; LCSC Part Name: 输出:3.3V 电流:1A 耐压:12V; Supplier Part: C347222; Manufacturer: UMW(友台半导体); Supplier Footprint: SOT-223; JLCPCB Part Class: 扩展库; Datasheet: https://atta.szlcsc.com/upload/public/pdf/source/20241218/BAF0263FA2E44BCD8AF41AA4FA04EFAA.pdf; Supplier: LCSC; Output Type: 固定; Maximum Input Voltage: 12V; Output Voltage: 3.3V; Output Current: 1A; Power Supply Rejection Ratio (PSRR): 60dB@(120Hz); Dropout Voltage: 1.3V@(1A); Feature: 过流保护(OCP); Output Polarity: 正极; Number of Outputs: 1
U3 = LM2596S-5.0_C347421: 功能类型:降压型;输出类型:固定;输入电压:40V;输出电压:5V;输出电流(最大值):3A;; LCSC Part Name: 降压型 输入40V 输出5V 3A; Supplier Part: C347421; Manufacturer: UMW(广东友台半导体); Supplier Footprint: TO-263-5; JLCPCB Part Class: 扩展库; Datasheet: https://atta.szlcsc.com/upload/public/pdf/source/20211011/C7416AEF3194BD283261B8F2553C4145.pdf; Supplier: LCSC; Function: 降压型; Synchronous Rectification: 否; Output Type: 固定; Number of Outputs: 1; Topology: 降压式; Input Voltage: 40V; Output Voltage: 5V; Output Current (Max): 3A; Switching Frequency: 150kHz; Operating Temperature: -40℃~+125℃@(TA)
U5 = 78M05_C347278: 输出类型:固定;最大输入电压:35V;输出电压:5V;输出电流:1A;电源纹波抑制比(PSRR):80dB@(120Hz);输出极性:正极;; LCSC Part Name: 输入35V 输出5V; Supplier Part: C347278; Manufacturer: UMW(友台半导体); Supplier Footprint: TO-252-2; JLCPCB Part Class: 扩展库; Datasheet: https://atta.szlcsc.com/upload/public/pdf/source/20240827/0E07D62EB5B1694607256ADF81712489.pdf; Supplier: LCSC; Output Type: 固定; Maximum Input Voltage: 35V; Output Voltage: 5V; Output Current: 1A; Power Supply Rejection Ratio (PSRR): 80dB@(120Hz); Dropout Voltage: 2V@(500mA); standby current: 6mA; Feature: 短路保护；热保护(TSD); Operating Temperature: -20℃~+85℃; Output Polarity: 正极; Number of Outputs: 1
U6 = MC34063ADR: 功能类型:升降压型;输出类型:可调;输入电压:3V~40V;输出电压:1.25V~40V;输出电流(最大值):1.5A;; Supplier Part: C100023; Manufacturer: TI(德州仪器); Supplier Footprint: SOIC-8; JLCPCB Part Class: 扩展库; Datasheet: https://www.ti.com/cn/lit/gpn/mc33063a; Supplier: LCSC; Function: 升降压型; Output Type: 可调; Input Voltage: 3V~40V; Output Voltage: 1.25V~40V; Output Current (Max): 1.5A; Switching Frequency: 100kHz; Operating Temperature: 0℃~+70℃@(TA); Synchronous Rectification: 否; Number of Outputs: 1; Topology: 升压式；降压式; Switch tube (built-in/external): 内置
U25 = TPS5430DDAR: 功能类型:降压型;输出类型:可调;工作电压:5.5V~36V;输出电压:1.221V~32.04V;输出电流:3A;; LCSC Part Name: 宽输入范围、3A输出电流的降压转换器; Supplier Part: C9864; Manufacturer: TI(德州仪器); Supplier Footprint: SOIC-8-EP; JLCPCB Part Class: 基础库; Datasheet: https://www.ti.com/cn/lit/gpn/tps5430; Supplier: LCSC; Function: 降压型; Output Type: 可调; Input Voltage: 5.5V~36V; Output Voltage: 1.221V~32.04V; Output Current: 3A; Switching Frequency: 500kHz; Operating Temperature: -40℃~+125℃@(TJ); Synchronous Rectification: 否; Number of Outputs: 1; Topology: 降压式; Switch tube (built-in/external): 内置

## Nets
3.3V: C7.2 C8.2 C28.2 C36.2 C37.2 C38.2 C39.2 LED2.2(+) R18.1 R20.1 R27.2 R74.2 R75.2 R78.1 U2.2(VOUT(TAB)) U2.4(TAB) U11.2(VCC) U14.5(VCC) U14.8(V3) U15.5(VCC) U15.8(V3)
5V: C1.2 C2.1 C5.2 C6.2 C9.2 C10.2 C20.2 C21.2 C30.2 CN2.1 L1.1 LED1.2(+) R12.2 R13.2 U2.3(VIN) U3.4(FB) U4.3(VIN) U7.3(VIN) U10.3(VCC) U13.2(VCC) U13.4(VCC)
12V: C3.2 C4.1 P9.2 R22.2 U1.1 U1.2 U3.1(VIN)
14V: C13.1 C14.2 C49.1 C50.1 D2.2(K) D4.1(A) D5.1(A) D6.1(A) D7.1(A) LED4.2(+) R4.2 R51.2 R52.2 R54.2 R66.2 R67.2 R68.2 U17.2(VCC) U18.2(VCC) U19.2(VCC) U20.2(VCC) U21.8(VCC) U22.8(VCC)
AGND: C50.2 C52.1 C53.1 R62.2 R64.1 R89.1 U22.4(GND)
GND: C1.1 C2.2 C3.1 C4.2 C5.1 C6.1 C7.1 C8.1 C9.1 C10.1 C11.1 C12.1 C13.2 C14.1 C15.1 C16.2 C17.1 C18.1 C19.1 C20.1 C21.1 C22.1 C23.1 C29.2 C30.1 C31.2 C32.1 C33.1 C34.2 C35.1 C36.1 C37.1 C38.1 C39.1 C40.2 C41.1 C49.2 C51.1 C54.2 C55.1 C60.1 C69.1 CN1.2 CON1.1 CON2.1 CON3.1 CON4.1 D1.2(A) P9.1 Q10.2(E) R1.1 R2.1 R6.1 R7.1 R8.1 R10.1 R25.1 R26.2 R28.2 R29.2 R30.2 R42.1 R43.1 R57.1 R58.1 R60.1 R69.1 R70.1 R71.1 R77.1 R80.2 R85.2 R86.2 R87.1 R88.2 R89.2 SW1.1 SW2.1 SW3.1 SW4.1 SW5.1 U2.1(ADJ(GND)) U3.3(GND) U3.5(ON#/OFF) U3.6(EP) U4.1(ADJ(GND)) U5.2(GND) U6.2(SWE) U6.4(GND) U7.1(ADJ(GND)) U9.11(FSYNC) U9.18(GND) U9.20(RESV) U9.25(EP) U10.2(GND) U10.8(S) U12.9(GND) U12.11(GND) U13.1(GND) U13.3(GND) U14.3(GND) U15.3(GND) U16.1 U17.4(GND) U18.4(GND) U19.4(GND) U20.4(GND) U21.4(GND) U23.4(GND) USB1.1(EP) USB1.2(EP) USB1.3(EP) USB1.4(EP) USB1.A1(GND) USB1.A12(GND) USB1.B1(GND) USB1.B12(GND) USB2.1(EP) USB2.2(EP) USB2.3(EP) USB2.4(EP) USB2.A1(GND) USB2.A12(GND) USB2.B1(GND) USB2.B12(GND)
PGND: R48.1 R50.1 R88.1
PGND_EN: C58.2 C59.2 CN2.2 R86.1
PGND_IMU: Q1.2(S) R19.1 R87.2
VCC_BAT: C17.2 C18.2 C60.2 C61.2 C62.2 CN1.1 Q2.2(D) Q3.2(D) Q4.2(D) Q5.2(D) U1.3 U5.1(IN) U25.7(VIN)
AUX_DA: R24.2 U9.21(AUX_DA) U12.16(SDA)
AUX_SCL: R23.2 U9.7(AUX_CL) U12.1(SCK)
BAT_ADC: C34.1 R22.1 R25.2 U13.11(A11)
BEEP: R79.1 R80.1 U13.28(33.10)
C1_ADC: R53.2 U13.21(A0)
C2_ADC: R55.2 U13.20(A1)
CAN_RXD: U10.4(RXD) U13.91(02.1)
CAN_TXD: U10.1(TXD) U13.90(02.0)
DEBUG_RX: U13.89(10.6) U15.6(TXD)
DEBUG_TX: U13.88(10.5) U15.7(RXD)
EN1: R43.2 U13.94(02.4) U17.3(DT/SD) U19.3(DT/SD)
EN2: R42.2 U13.95(02.5) U18.3(DT/SD) U20.3(DT/SD)
ENCODER1_A: C58.1 CN2.4 R74.1 U13.25(33.7)
ENCODER1_B: C59.1 CN2.3 R75.1 U13.24(33.6)
ENCODER2_A: U13.87(10.3)
ENCODER2_B: U13.85(10.1)
HEAT_PWM: R17.1 U13.97(02.7)
IMU_3.3V: C22.2 C23.2 C29.1 C32.2 C35.2 LED6.2(+) R23.1 R24.1 U7.2(VOUT(TAB)) U7.4(TAB) U9.8(VDDIO) U9.13(VDD) U12.2(VDD)
IMU_INT: U9.12(INT) U13.70(14.3)
IN1_1: R52.1 U19.1(IN) U21.1(1OUT)
IN1_2: R54.1 U17.1(IN) U21.7(2OUT)
IN2_1: R67.1 U20.1(IN) U23.1(1OUT)
IN2_2: R68.1 U18.1(IN) U23.7(2OUT)
KEY1: SW1.2 U13.49(20.6)
KEY2: SW2.2 U13.50(20.7)
KEY3: SW3.2 U13.78(11.2)
KEY4: SW4.2 U13.79(11.3)
LED0: LED8.1(-) U13.30(33.12)
M1_CURRENT: Q6.3(S) Q7.3(S) R48.2 R61.1
M2_CURRENT: Q8.3(S) Q9.3(S) R50.2 R63.2
MCU_IN1_1: R58.2 U13.38(21.2) U21.3(1IN+)
MCU_IN1_2: R60.2 U13.39(21.3) U21.5(2IN+)
MCU_IN2_1: R70.2 U13.40(21.4) U23.3(1IN+)
MCU_IN2_2: R71.2 U13.41(21.5) U23.5(2IN+)
MOTOR_5V: C15.2 C16.1 LED11.2(+) R3.2 U5.3(OUT) U6.6(VCC)
SCL: R18.2 U11.3(SCL) U13.76(13.2)
SDA: R20.2 U11.4(SDA) U13.75(13.1)
SERVO_6V35: C65.2 C66.2 C67.2 C68.2 L4.1 R81.2 U24.2
SERVO_PWM: U13.27(33.9) U24.1
SERVOR_GND: C61.1 C62.1 C64.1 C65.1 C66.1 C67.1 C68.1 D8.1(A) R82.1 R85.1 U24.3 U25.6(GND) U25.9(PowerPAD)
SPI_MISO: U9.9(SDO/AD0) U13.55(20.12)
SPI_MOSI: U9.24(SDA/SDI) U13.57(20.14)
SPI_NSS: U9.22(nCS) U13.56(20.13)
SPI_SCK: U9.23(SCL/SCLK) U13.54(20.11)
U1_CC1: R26.1 USB1.A5(CC1)
U1_CC2: R28.1 USB1.B5(CC2)
U1_USBD+: U14.1(UD+) USB1.A6(DP1) USB1.B6(DP2)
U1_USBD-: U14.2(UD-) USB1.A7(DN1) USB1.B7(DN2)
U2_CC1: R29.1 USB2.A5(CC1)
U2_CC2: R30.1 USB2.B5(CC2)
U2_USBD+: U15.1(UD+) USB2.A6(DP1) USB2.B6(DP2)
U2_USBD-: U15.2(UD-) USB2.A7(DN1) USB2.B7(DN2)
UP_RX: U13.59(15.1) U14.6(TXD)
UP_TX: U13.58(15.0) U14.7(RXD)
WIFI_3.3V: C11.2 C12.2 C40.1 C41.2 LED3.2(+) R31.1 R32.2 R34.2 U4.2(VOUT(TAB)) U4.4(TAB) U16.2
WIFI_LINK: LED10.1(-) U13.105(00.6) U16.8
WIFI_NRST: U13.106(00.7) U16.7
WIFI_READY: LED9.1(-) U13.104(00.5) U16.9
WIFI_RX: U13.65(15.7) U16.3
WIFI_TX: U13.64(15.6) U16.4
$1N1982: D1.1(C) L1.2 U3.2(OUT)
$1N4550: LED1.1(-) R1.2
$1N4630: LED2.1(-) R2.2
$1N5512: D2.1(A) L2.2 U6.1(SWC)
$1N5995: LED4.1(-) R8.2
$1N6062: C19.2 U6.3(TCAP)
$1N6242: R5.2 U6.8(DRC)
$1N9356: LED3.1(-) R6.2
$1N9942: LED6.1(-) R10.2
$1N28494: LED11.1(-) R77.2
$1N33755: R4.1 R7.2 U6.5(COMP)
$1N33784: L2.1 R3.1 R5.1 U6.7(IPK)
$1N39553: C63.2 U25.1(BOOT)
$1N39664: C63.1 D8.2(K) L4.2
$1N40118: C64.2 R81.1 R82.2 U25.4(VSENSE)
$5N4200: C31.1 U9.10(REGOUT)
$5N6459: C33.2 U12.10(C1)
$5N17183: C69.2 R31.2 SW5.2 U16.10
$5N17688: LED8.2(+) R27.1
$5N17736: LED9.2(+) R32.1
$5N17775: LED10.2(+) R34.1
$5N19499: Q1.3(D) R12.1 R13.1
$5N19504: Q1.1(G) R17.2 R19.2
$5N33679: BUZZER1.1(+) R78.2
$5N33846: Q10.1(B) R79.2
$5N33850: BUZZER1.2 Q10.3(C)
$6N266: C45.1 C47.2 P2.1 Q2.3(S) Q6.2(D) U19.6(VOUT)
$6N267: C43.1 C47.1 P2.2 Q3.3(S) Q7.2(D) U17.6(VOUT)
$6N4714: R37.1 U19.7(HVG)
$6N4718: Q2.1(G) R37.2
$6N4737: R45.1 U19.5(LVG)
$6N4742: Q6.1(G) R45.2
$6N4785: C45.2 D6.2(K) U19.8(VBOOT)
$6N4937: Q3.1(G) R35.1
$6N4944: Q7.1(G) R39.1
$6N4973: R35.2 U17.7(HVG)
$6N4991: R39.2 U17.5(LVG)
$6N5044: C43.2 D4.2(K) U17.8(VBOOT)
$6N7958: C52.2 R61.2 U22.3(1IN+)
$6N7962: R56.1 R62.1 U22.2(1IN-)
$6N8007: R53.1 R56.2 U22.1(1OUT)
$6N8497: C51.2 R51.1 R57.2 U21.2(1IN-) U21.6(2IN-)
Net-(C28-1): C28.1 U11.1(GND)
Net-(C44-1): C44.1 C48.1 P3.2 Q5.3(S) Q9.2(D) U18.6(VOUT)
Net-(C44-2): C44.2 D5.2(K) U18.8(VBOOT)
Net-(C46-1): C46.1 C48.2 P3.1 Q4.3(S) Q8.2(D) U20.6(VOUT)
Net-(C46-2): C46.2 D7.2(K) U20.8(VBOOT)
Net-(C53-2): C53.2 R63.1 U22.5(2IN+)
Net-(C54-1): C54.1 U23.8(VCC)
Net-(C55-2): C55.2 R66.1 R69.2 U23.2(1IN-) U23.6(2IN-)
Net-(P1-1): P1.1 R16.1 U10.7(CANH)
Net-(P1-2): P1.2 R16.2 U10.6(CANL)
Net-(Q4-1): Q4.1(G) R38.2
Net-(Q5-1): Q5.1(G) R36.1
Net-(Q8-1): Q8.1(G) R46.2
Net-(Q9-1): Q9.1(G) R41.1
Net-(R36-2): R36.2 U18.7(HVG)
Net-(R38-1): R38.1 U20.7(HVG)
Net-(R41-2): R41.2 U18.5(LVG)
Net-(R46-1): R46.1 U20.5(LVG)
Net-(R55-1): R55.1 R59.2 U22.7(2OUT)
Net-(R59-1): R59.1 R64.2 U22.6(2IN-)

Not connected (* = marked no-connect by the designer): U9 1(NC)* 2(NC)* 3(NC)* 4(NC)* 5(NC)* 6(NC)* 14(NC)* 15(NC)* 16(NC)* 17(NC)* 19(RESV)*; U10 5(VREF)*; U12 3(NC)* 4(NC)* 5(NC)* 6(NC)* 7(NC)* 8(NC)* 12(NC)* 13(NC)* 14(NC)* 15(NC)*; U13 5(A21)* 6(A20)* 7(A17)* 8(A16)* 9(A13)* 10(A12)* 12(A10)* 13(A8)* 14(A7)* 15(A6)* 16(A5)* 17(A4)* 18(A3)* 19(A2)* 22(33.4)* 23(33.5)* 26(33.8)* 29(33.11)* 31(33.13)* 32(32.4)* 33(23.1)* 34(22.0)* 35(22.1)* 36(22.2)* 37(22.3)* 42(21.6)* 43(21.7)* 44(20.0)* 45(20.2)* 46(20.3)* 47(ESR1)* 48(ESR0)* 51(20.8)* 52(20.9)* 53(20.10)* 60(15.2)* 61(15.3)* 62(15.4)* 63(15.5)* 66(15.8)* 67(14.0)* 68(14.1)* 69(14.2)* 71(14.4)* 72(14.5)* 73(14.6)* 74(13.0)* 77(13.3)* 80(11.6)* 81(11.9)* 82(11.10)* 83(11.11)* 84(11.12)* 86(10.2)* 92(02.2)* 93(02.3)* 96(02.6)* 98(02.8)* 99(00.0)* 100(00.1)* 101(00.2)* 102(00.3)* 103(00.4)* 107(00.8)* 108(00.9)* 109(00.12)* 110(A49)* 111(A48)* 112(A47)* 113(A46)* 114(A45)* 115(A44)* 116(A39)* 117(A38)* 118(A37)* 119(A36)* 120(A35)* 121(A25)* 122(A24)*; U14 4(RTS#)*; U15 4(RTS#)*; U16 5* 6* 11* 12* 13* 14*; U25 2(NC)* 3(NC)* 5(ENA)* 8(PH); USB1 A4(VBUS)* A8(SUB1)* A9(VBUS)* B4(VBUS)* B8(SUB2)* B9(VBUS)*; USB2 A4(VBUS)* A8(SUB1)* A9(VBUS)* B4(VBUS)* B8(SUB2)* B9(VBUS)*

## Notes on the sheets
sheet 1
- [POWER]
- 5V主电源
- 3.3V主电源
- wifi电源
- 电机驱动5V电源
- 电机驱动14V电源
- 舵机电源
- MPU电源
sheet 2
- 姿态传感器
- OLED
- CAN
- IMU温度补偿
- 蜂鸣器
- 【六轴传感器】
- 电池电量
- 逐飞核心
- 【地磁计】
- 串口
- LED运行灯
- 按键
- 【通讯串口】
- 舵机
- 【调试串口】
- 编码器
- WIFI
sheet 3
- 【电机】
- 电机1
- 电机2
- 【电机电流采样】
- 【比较器输入】
